# Altium project Shunt_Akım_Devresi.PrjPcb (part 1 of 2)
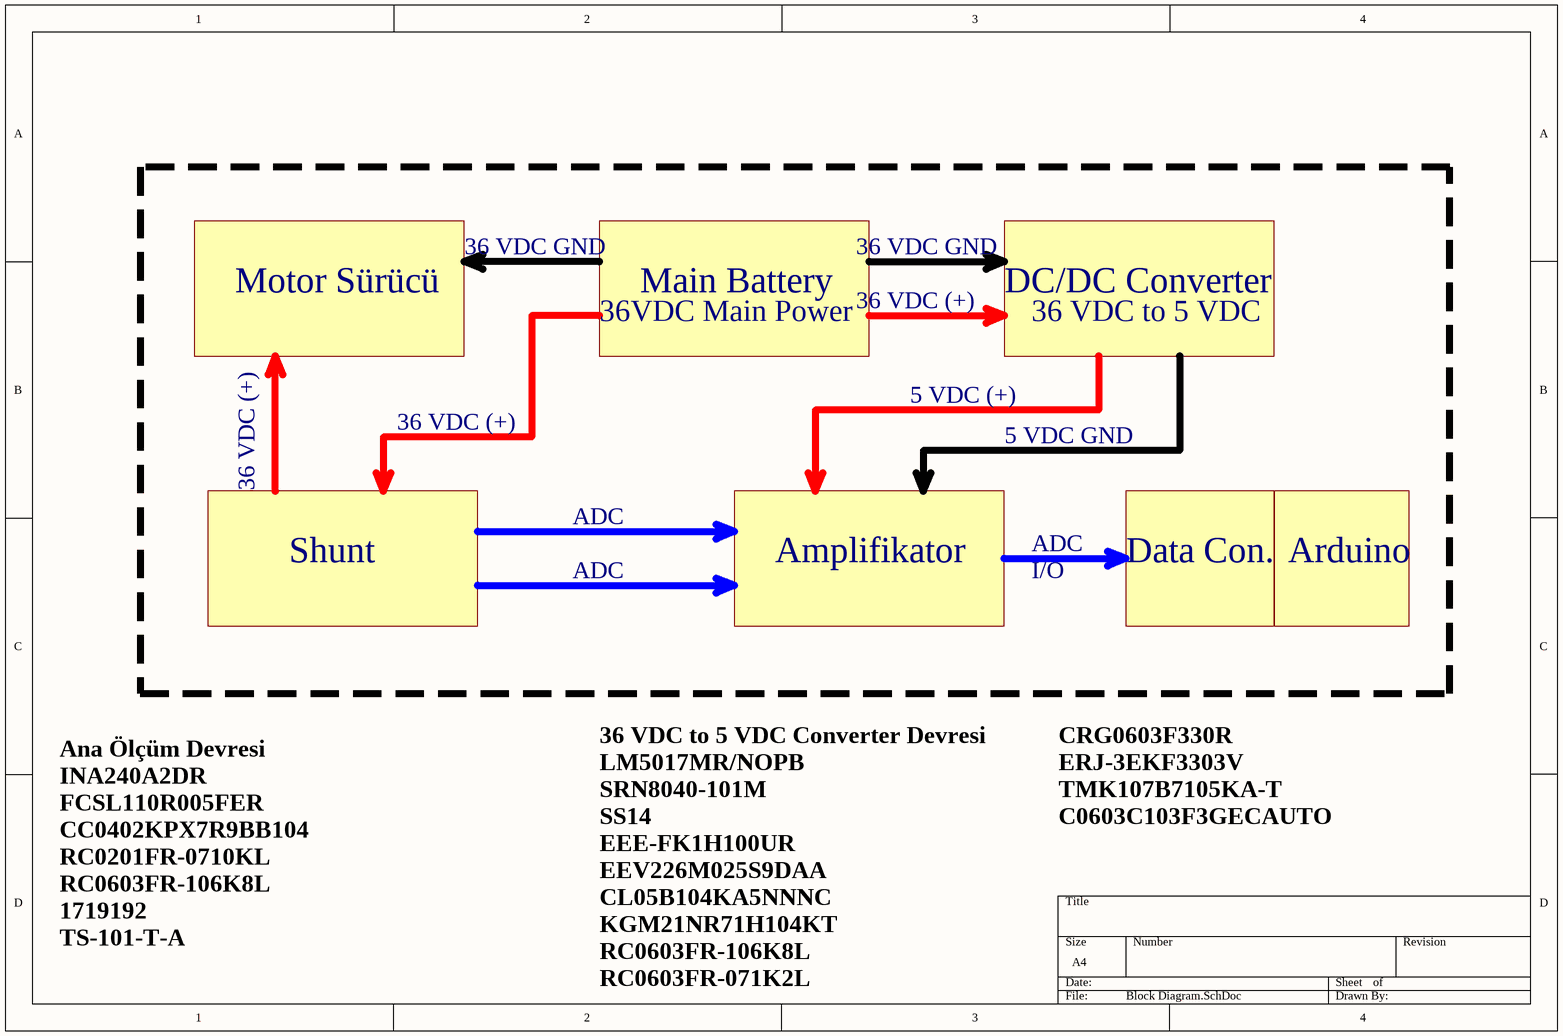
[diagram p0: Block Diagram.SchDoc]
3 sheets, 27 parts. Net scope: flat (ports and power ports of the same name join across sheets).
Board file: PCB1.PcbDoc
Sheets:
  Block Diagram.SchDoc
  Akım Algılama.SchDoc
  5V Converter.SchDoc

## Sheet Block Diagram.SchDoc
size A4; SheetNumber: 2; SheetTotal: 4

### Notes on the sheet
- Motor Sürücü
- 36 VDC GND
- Main Battery
- 36 VDC (+)
- DC/DC Converter
- 36VDC Main Power
- 36 VDC to 5 VDC
- 5 VDC (+)
- 5 VDC GND
- Shunt
- ADC
- Amplifikator
- I/O
- Data Con.
- Arduino
- CRG0603F330R
  ERJ-3EKF3303V
  TMK107B7105KA-T
  C0603C103F3GECAUTO
- Ana Ölçüm Devresi
  INA240A2DR
  FCSL110R005FER
  CC0402KPX7R9BB104
  RC0201FR-0710KL
  RC0603FR-106K8L
  1719192
  TS-101-T-A
- 36 VDC to 5 VDC Converter Devresi
  LM5017MR/NOPB
  SRN8040-101M
  SS14
  EEE-FK1H100UR
  EEV226M025S9DAA
  CL05B104KA5NNNC
  KGM21NR71H104KT
  RC0603FR-106K8L
  RC0603FR-071K2L

## Sheet Akım Algılama.SchDoc
size A4; SheetNumber: 2; SheetTotal: 3
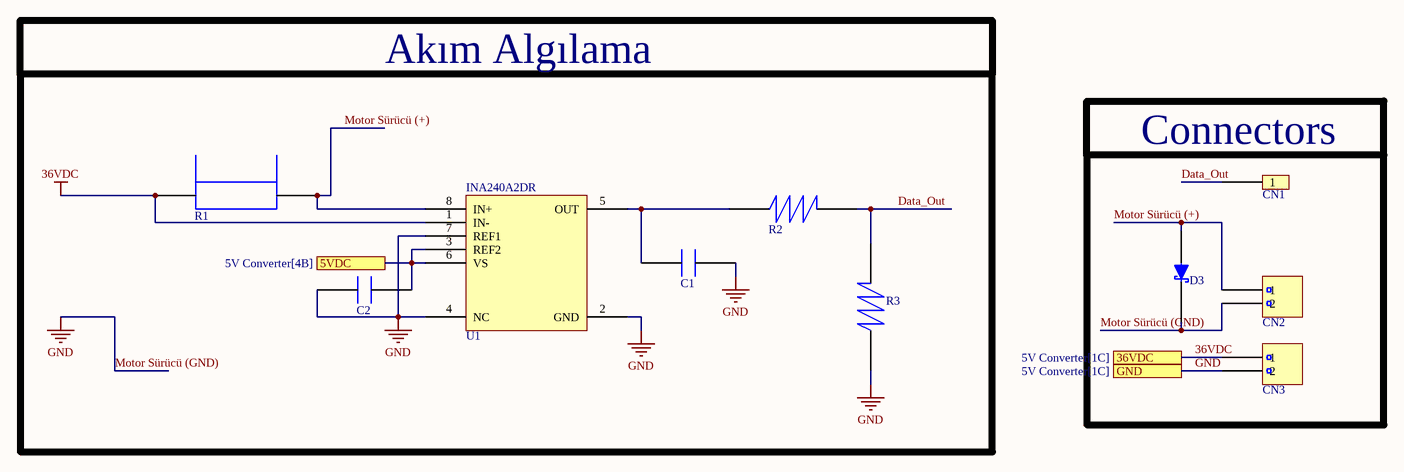
[diagram p1: Akım Algılama.SchDoc]

### Parts
C1  CC0402KPX7R9BB104  [CAP_1005]  (value not drawn)
C2  CC0402KPX7R9BB104  [CAP_1005]  (value not drawn)
CN1  TS-101-T-A  [TS-101-T-A]  (value not drawn)
CN2  1719192  [1719192]  (value not drawn)
CN3  1719192  [1719192]  (value not drawn)
D3  SS14  [SMA-2 (SS14)]  (value not drawn)
R1  FCSL110R005FER  [FCSL110]  (value not drawn)
R2  RC0201FR-0710KL  [RES_0603]  (value not drawn)
R3  RC0603FR-106K8L  [RES_0603]  (value not drawn)
U1  INA240A2DR  [SOIC8]

### Blocks framed on the sheet
Akım Algılama: C1 C2 R1-R3 U1
Connectors: CN1-CN3 D3

### Ports
5VDC (see 5V Converter[4B]), 36VDC (see 5V Converter[1C]), GND (see 5V Converter[1C])

### Nets
36VDC: CN3.1 R1.0 U1.1(IN-) ; port 36VDC
GND: C1.1 C2.2 CN2.2 CN3.2 D3.1 R3.1 U1.2(GND) U1.4(NC) U1.7(REF1) ; port GND  [also labelled Motor Sürücü (GND)]
Data_Out: CN1.1 R2.2 R3.2
Motor Sürücü (+): CN2.1 D3.2 R1.1 U1.8(IN+)
NetC1_2: C1.2 R2.1 U1.5(OUT)
NetC2_1: C2.1 U1.3(REF2) U1.6(VS) ; port 5VDC

### Library data of the parts
C1 C2 = CC0402KPX7R9BB104: CAP 0402 50V 100 NF X7R; Manufacturer: Yageo; Designed by: ismet Akalın; Supplier: Farnell; Supplier Part Number: 4254870; Manufacturer Part Number: CC0402KPX7R9BB104; RoHS: Yes; Category: Ceramic Capacitors; Stock: 13930; Pricing: 10=0,0234, 500=0,0229, 2500=0,0187, 10000=0,0155, 25000=0,0144, 50000=0,0122 (EUR)
CN1 = TS-101-T-A: CONN HEADER VERT 1POS; Manufacturer: Samtec; Designed by: ismet Akalın; Connector Type: BOARD CONNECTOR; Option: General Purpose; Filter Feature: No; Mating Information: MULTIPLE MATING PARTS AVAILABLE; Number of Rows Loaded: 1; Number of Contacts: 34; Contact Pattern: RECTANGULAR; Contact Style: RND PIN-SKT; Body Breadth: 0.1inch; Plating Thickness: 200uin; Reference Standard: UL; Reliability: COMMERCIAL; Supplier: Mouser; Supplier Part Number: 200-TS101TA; Manufacturer Part Number: TS-101-T-A; RoHS: Yes; Category: Connectors; Stock: 1900; Pricing: 1=0,19, 10=0,19, 50=0,15, 100=0,12, 1000=0,08, 10000=0,06 (USD); Mounting Technology: Board; Contact Material: Brass; Contact Finish - Mating: TIN OVER COPPER (100); Contact Finish - Termination: TIN OVER COPPER (100); Insulation Color: Black; Insulation Material: Glass; Min Operating Temperature: -55°C; Max Operating Temperature: 105°C; Contact Gender: Male; Mixed Contacts: No; Mounting Style: STRAIGHT; Termination: Solder; Number Of Connectors: 1; Number Of PCB Rows: 1; PCB Contact Pattern: RECTANGULAR; Terminal Pitch: 2.54mm; Body Length: 0.1inch; Mating Contact Pitch: 0.1inch; Terminal Length: 0.156inch; DIN Conformance: No; IEC Conformance: No; MIL Conformance: No; Reach SVHC Compliant: Yes; RoHS Compliant: Yes; ComponentLink1URL: https://datasheet.ciiva.com:443/pdfs/VipMasterIC/IC/SAMI/SAMI-S-A0003554998/SAMI-S-A0003554998-1.pdf?src-supplier=IHS+Markit; ComponentLink1Description: https://datasheet.ciiva.com:443/pdfs/VipMasterIC/IC/SAMI/SAMI-S-A0003554998/SAMI-S-A0003554998-1.pdf?src-supplier=IHS+Markit; ComponentLink2URL: https://datasheet.ciiva.com/410/tx-1xx-x-x-mkt1-410197.pdf?src-supplier=Digikey; ComponentLink2Description: https://datasheet.ciiva.com/410/tx-1xx-x-x-mkt1-410197.pdf?src-supplier=Digikey
CN2 CN3 = 1719192: TERM BLK 2POS SIDE ENT 7.5MM PCB; Manufacturer: Phoenix Contact; Designed by: ismet Akalın; Fastening Method: SPRING LOADED; Number of Decks: 1; Number of Ways: 2; Current Rating: 41A; Voltage Rating: 800V; Wire Cross Section: 6mm2; Wire/Cable Gauge: 8AWG; Safety Approval: UL; Supplier: Mouser; Supplier Part Number: 651-1719192; Manufacturer Part Number: 1719192; RoHS: Yes; Category: Terminal Blocks; Stock: 2635; Pricing: 1=4,6, 10=4,49, 50=4,2, 100=3,86, 1000=3,21, 10000=3,13 (USD); Mounting Technology: Board; Manufacturer Series: 1719192; Number of Rows: 1; Terminal and Terminal Block Type: BARRIER STRIP TERMINAL BLOCK; Reach SVHC Compliant: Yes; RoHS Compliant: Yes; ComponentLink1URL: https://datasheet.ciiva.com:443/pdfs/VipMasterIC/IC/PCON/PCONS08451/PCONS08451-1.pdf?src-supplier=IHS+Markit; ComponentLink1Description: https://datasheet.ciiva.com:443/pdfs/VipMasterIC/IC/PCON/PCONS08451/PCONS08451-1.pdf?src-supplier=IHS+Markit; ComponentLink2URL: https://datasheet.ciiva.com/832/1719192-832388.pdf?src-supplier=Digikey; ComponentLink2Description: https://datasheet.ciiva.com/832/1719192-832388.pdf?src-supplier=Digikey; ComponentLink3URL: https://datasheet.ciiva.com/18619/1719192-18619035.pdf?src-supplier=Digikey; ComponentLink3Description: https://datasheet.ciiva.com/18619/1719192-18619035.pdf?src-supplier=Digikey
D3 = SS14: DIODE SCHOTTKY 40V 1A DO214AC; Manufacturer: ON Semiconductor / Fairchild; Designed by: ismet Akalın; Package Body Material: Plastic; Diode Element Material: SILICON; Diode Type: RECTIFIER; Number of Elements: 1; Forward Voltage: 500mV; Max Power Dissipation: 1.1W; Additional Feature: FREE WHEELING DIODE; Non-rep Pk Forward Current-Max: 30A; Qualification Status: Not Qualified; JEDEC-95 Code: DO-214AC; Supplier: Mouser; Supplier Part Number: 512-SS14; Manufacturer Part Number: SS14; RoHS: Yes; Category: Schottky Diodes; Stock: 78089; Pricing: 1=0,29, 10=0,195, 50=0,195, 100=0,117, 1000=0,088, 10000=0,063 (USD); Pins: 2; Package Shape: Rectangular; Terminal Finish: Tin; Min Operating Temperature: -65°C; Max Operating Temperature: 125°C; JESD-30 Code: R-PDSO-C2; Surface Mount: Yes; Technology: SCHOTTKY; Terminal Form: C BEND; Terminal Position: DUAL; Max Output current: 1A; Package Style: SMALL OUTLINEMeter; Rep Pk Reverse Voltage-Max: 40V; Moisture Sensitivity Level: 1; JESD-609 Code: e3; RoHS Compliant: Yes; Reach SVHC Compliant: No; ComponentLink1URL: https://datasheet.ciiva.com:443/pdfs/VipMasterIC/IC/ONSM/ONSM-S-A0007316185/ONSM-S-A0007316185-1.pdf?src-supplier=IHS+Markit; ComponentLink1Description: https://datasheet.ciiva.com:443/pdfs/VipMasterIC/IC/ONSM/ONSM-S-A0007316185/ONSM-S-A0007316185-1.pdf?src-supplier=IHS+Markit; ComponentLink2URL: http://www.onlinecomponents.com/datasheet/ss14.aspx?p=11369800&src-supplier=Onlinecomponents.com; ComponentLink2Description: http://www.onlinecomponents.com/datasheet/ss14.aspx?p=11369800&src-supplier=Onlinecomponents.com; ComponentLink3URL: http://www.produktinfo.conrad.com/datenblaetter/1200000-1299999/001265127-da-01-en-DIODE_SCHOTTKY_40V_1A_SS14_DO_214_AC_FSC.pdf?src-supplier=Conrad; ComponentLink3Description: http://www.produktinfo.conrad.com/datenblaetter/1200000-1299999/001265127-da-01-en-DIODE_SCHOTTKY_40V_1A_SS14_DO_214_AC_FSC.pdf?src-supplier=Conrad; ComponentLink4URL: https://www.verical.com/server-webapp/html/getDatasheet?partID=84776&src-supplier=Verical; ComponentLink4Description: https://www.verical.com/server-webapp/html/getDatasheet?partID=84776&src-supplier=Verical; ComponentLink5URL: https://datasheet.octopart.com/SS14.-Fairchild-Semiconductor-datasheet-3545.pdf?src-supplier=Element14; ComponentLink5Description: https://datasheet.octopart.com/SS14.-Fairchild-Semiconductor-datasheet-3545.pdf?src-supplier=Element14
R1 = FCSL110R005FER: RES 0.005 OHM 5W 4320 WIDE; Manufacturer: Ohmite; Designed by: ismet Akalın; Tolerance: 1%; Rated Temperature: 70°C; Value: 5mR; Temperature Coefficient (ppm/Cel): 50; Package Height: 0.5mm; Package Length: 11mm; Package Width: 5mm; Supplier: Mouser; Supplier Part Number: 588-FCSL110R005FER; Manufacturer Part Number: FCSL110R005FER; RoHS: Yes; Category: Chip SMD Resistors; Stock: 2484; Pricing: 1=2,58, 10=1,49, 50=1,35, 100=1,08, 1000=0,997, 10000=0,997 (USD); Mounting Technology: Surface Mount; Pins: 2; Case/Package: 4320; Min Operating Temperature: -55°C; Max Operating Temperature: 155°C; Resistor Type: FIXED RESISTOR; Construction: Rectangular; Packaging: Tape and Reel; Power: 5W; Technology: METAL FOIL; Termination: Wraparound; Reach SVHC Compliant: Yes; RoHS Compliant: Yes; ComponentLink1URL: https://datasheet.ciiva.com:443/pdfs/VipMasterIC/IC/OMIT/OMIT-S-A0006531105/OMIT-S-A0006531105-1.pdf?src-supplier=IHS+Markit; ComponentLink1Description: https://datasheet.ciiva.com:443/pdfs/VipMasterIC/IC/OMIT/OMIT-S-A0006531105/OMIT-S-A0006531105-1.pdf?src-supplier=IHS+Markit; ComponentLink2URL: https://datasheet.ciiva.com/2484/res-fcsl-2484643.pdf?src-supplier=Digikey; ComponentLink2Description: https://datasheet.ciiva.com/2484/res-fcsl-2484643.pdf?src-supplier=Digikey; ComponentLink3URL: https://datasheet.ciiva.com/2484/res-fcsl-2484644.pdf?src-supplier=Digikey; ComponentLink3Description: https://datasheet.ciiva.com/2484/res-fcsl-2484644.pdf?src-supplier=Digikey; ComponentLink4URL: https://datasheet.ciiva.com/2484/res-fcsl-2484645.pdf?src-supplier=Digikey; ComponentLink4Description: https://datasheet.ciiva.com/2484/res-fcsl-2484645.pdf?src-supplier=Digikey; ComponentLink5URL: https://datasheet.ciiva.com/6181/fcsl-6181333.pdf?src-supplier=Farnell; ComponentLink5Description: https://datasheet.ciiva.com/6181/fcsl-6181333.pdf?src-supplier=Farnell; ComponentLink6URL: https://datasheet.ciiva.com/8080/fcsl-8080343.pdf?src-supplier=Element14; ComponentLink6Description: https://datasheet.ciiva.com/8080/fcsl-8080343.pdf?src-supplier=Element14; ComponentLink7URL: https://datasheet.ciiva.com/46422/1812595-46422917.pdf?src-supplier=Element14; ComponentLink7Description: https://datasheet.ciiva.com/46422/1812595-46422917.pdf?src-supplier=Element14
R2 = RC0201FR-0710KL: RES 10K OHM 1% 1/20W 0201; Manufacturer: Yageo; Manufacturer Part Number: RC0201FR-07100KL; Designed by: ismet Akalın; Additional Feature: LASER TRIMMABLE; Power: 50mW; Rated Temperature: 70°C; Value: 100kR; Working Voltage: 25V; Temperature Coefficient (ppm/Cel): 200; Package Height: 0.23mm; Package Length: 0.6mm; Package Width: 0.3mm; Supplier: Mouser; Supplier Part Number: 603-RC0201FR-07100KL; RoHS: Yes; Category: Chip SMD Resistors; Stock: 559460; Pricing: 1=0,1, 10=0,013, 50=0,013, 100=0,01, 1000=0,007, 10000=0,003 (USD); Mounting Technology: Surface Mount; Pins: 2; Package Shape: Rectangular; Case/Package: 0201; Terminal Finish: Nickel; Min Operating Temperature: -55°C; Max Operating Temperature: 125°C; Tolerance: 1%; JESD-609 Code: e3; Resistor Type: FIXED RESISTOR; Construction: Chip; Packaging: Tape and Reel; Technology: METAL GLAZE/THICK FILM; Termination: Wraparound; Reach SVHC Compliant: Yes; RoHS Compliant: Yes; ComponentLink1URL: https://datasheet.ciiva.com:443/pdfs/VipMasterIC/IC/YAGO/YAGO-S-A0008145938/YAGO-S-A0008145938-1.pdf?src-supplier=IHS+Markit; ComponentLink1Description: https://datasheet.ciiva.com:443/pdfs/VipMasterIC/IC/YAGO/YAGO-S-A0008145938/YAGO-S-A0008145938-1.pdf?src-supplier=IHS+Markit; ComponentLink2URL: https://datasheet.ciiva.com/2493/pyu-r-int-thick-7-2493769.pdf?src-supplier=Digikey; ComponentLink2Description: https://datasheet.ciiva.com/2493/pyu-r-int-thick-7-2493769.pdf?src-supplier=Digikey; ComponentLink3URL: https://datasheet.ciiva.com/2493/pyu-r-int-thick-7-2493770.pdf?src-supplier=Digikey; ComponentLink3Description: https://datasheet.ciiva.com/2493/pyu-r-int-thick-7-2493770.pdf?src-supplier=Digikey; ComponentLink4URL: https://datasheet.ciiva.com/2493/pyu-r-int-thick-7-2493771.pdf?src-supplier=Digikey; ComponentLink4Description: https://datasheet.ciiva.com/2493/pyu-r-int-thick-7-2493771.pdf?src-supplier=Digikey; ComponentLink5URL: https://datasheet.ciiva.com/7660/1421516-7660806.pdf?src-supplier=Element14; ComponentLink5Description: https://datasheet.ciiva.com/7660/1421516-7660806.pdf?src-supplier=Element14; ComponentLink6URL: https://datasheet.ciiva.com/22698/1563626-22698495.pdf?src-supplier=Element14; ComponentLink6Description: https://datasheet.ciiva.com/22698/1563626-22698495.pdf?src-supplier=Element14; ComponentLink7URL: https://datasheet.ciiva.com/46391/1421516-46391338.pdf?src-supplier=Element14; ComponentLink7Description: https://datasheet.ciiva.com/46391/1421516-46391338.pdf?src-supplier=Element14; ComponentLink8URL: https://datasheet.ciiva.com/26829/getdatasheetpartid-420441-26829850.pdf?src-supplier=Verical; ComponentLink8Description: https://datasheet.ciiva.com/26829/getdatasheetpartid-420441-26829850.pdf?src-supplier=Verical
R3 = RC0603FR-106K8L: RES 6.8K OHM 1% 1/10W 0603; Manufacturer: Yageo; Designed by: ismet Akalın; Additional Feature: LASER TRIMMABLE; Power: 100mW; Rated Temperature: 70°C; Value: 6.8kR; Working Voltage: 75V; Temperature Coefficient (ppm/Cel): 100; Package Height: 0.45mm; Package Length: 1.6mm; Package Width: 0.8mm; Supplier: Mouser; Supplier Part Number: 603-RC0603FR-106K8L; Manufacturer Part Number: RC0603FR-106K8L; RoHS: Yes; Category: Chip SMD Resistors; Stock: 27642; Pricing: 1=0,1, 10=0,009, 50=0,009, 100=0,007, 1000=0,006, 10000=0,002 (USD); Mounting Technology: Surface Mount; Pins: 2; Package Shape: Rectangular; Case/Package: 0603; Terminal Finish: Nickel; Min Operating Temperature: -55°C; Max Operating Temperature: 155°C; Tolerance: 1%; Termination: Wraparound; JESD-609 Code: e3; Resistor Type: FIXED RESISTOR; Construction: Chip; Packaging: Tape and Reel; Technology: METAL GLAZE/THICK FILM; Reach SVHC Compliant: Yes; RoHS Compliant: Yes; ComponentLink1URL: https://datasheet.ciiva.com:443/pdfs/VipMasterIC/IC/YAGO/YAGO-S-A0008145938/YAGO-S-A0008145938-1.pdf?src-supplier=IHS+Markit; ComponentLink1Description: https://datasheet.ciiva.com:443/pdfs/VipMasterIC/IC/YAGO/YAGO-S-A0008145938/YAGO-S-A0008145938-1.pdf?src-supplier=IHS+Markit; ComponentLink2URL: https://datasheet.ciiva.com/12561/rc0603-272842-12561433.pdf?src-supplier=Mouser; ComponentLink2Description: https://datasheet.ciiva.com/12561/rc0603-272842-12561433.pdf?src-supplier=Mouser
U1 = INA240A2DR: IC CURRENT SENSE 1 CIRCUIT 8SOIC; Manufacturer: Texas Instruments; Designed by: ismet Akalın; Throw Configuration: ANALOG CIRCUIT; Supplier: Mouser; Supplier Part Number: 595-INA240A2DR; Manufacturer Part Number: INA240A2DR; RoHS: Yes; Category: Amplifiers - Op Amps, Buffer, Instrumentation; Stock: 5129; Pricing: 1=2,53, 10=1,89, 50=1,72, 100=1,55, 1000=1,37, 10000=1,31 (USD); Terminal Finish: Nickel; JESD-609 Code: e4; Moisture Sensitivity Level: 2; Reach SVHC Compliant: Yes; RoHS Compliant: Yes; ComponentLink1URL: https://www.ti.com:443/lit/ds/symlink/ina240.pdf?src-supplier=IHS+Markit; ComponentLink1Description: https://www.ti.com:443/lit/ds/symlink/ina240.pdf?src-supplier=IHS+Markit; ComponentLink2URL: http://www.ti.com/lit/ds/symlink/ina240.pdf?src-supplier=Digikey; ComponentLink2Description: http://www.ti.com/lit/ds/symlink/ina240.pdf?src-supplier=Digikey